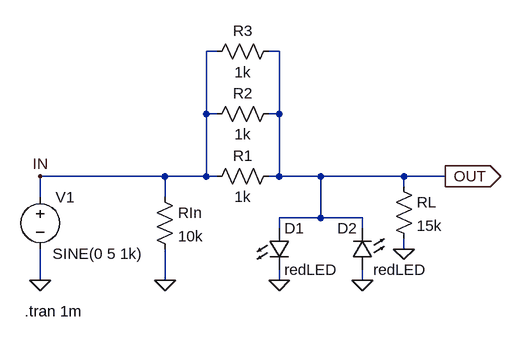
[diagram p0: schematic LED_Limiter_RL=15k_1kx3.asc]
LED_Limiter_RL=15k_1kx3.asc, the LTspice schematic file:
Version 4
SHEET 1 880 680
WIRE 128 -112 112 -112
WIRE 224 -112 208 -112
WIRE 112 -16 112 -112
WIRE 128 -16 112 -16
WIRE 224 -16 224 -112
WIRE 224 -16 208 -16
WIRE 48 80 -144 80
WIRE 112 80 112 -16
WIRE 112 80 48 80
WIRE 128 80 112 80
WIRE 224 80 224 -16
WIRE 224 80 208 80
WIRE 288 80 224 80
WIRE 416 80 288 80
WIRE 480 80 416 80
WIRE 416 96 416 80
WIRE -144 112 -144 80
WIRE 48 112 48 80
WIRE 288 144 288 80
WIRE 288 144 224 144
WIRE 352 144 288 144
WIRE 224 160 224 144
WIRE 352 160 352 144
WIRE 416 192 416 176
WIRE -144 240 -144 192
WIRE 48 240 48 192
WIRE 224 240 224 224
WIRE 352 240 352 224
FLAG 480 80 OUT
IOPIN 480 80 Out
FLAG -144 240 0
FLAG 224 240 0
FLAG 352 240 0
FLAG -144 80 IN
FLAG 416 192 0
FLAG 48 240 0
SYMBOL voltage -144 96 R0
WINDOW 3 19 103 Left 2
WINDOW 123 0 0 Left 2
WINDOW 39 0 0 Left 2
SYMATTR Value SINE(0 5 1k)
SYMATTR InstName V1
SYMBOL LED 208 160 R0
SYMATTR InstName D1
SYMATTR Value redLED
SYMBOL LED 368 224 R180
WINDOW 0 24 64 Left 2
WINDOW 3 -83 0 Left 2
SYMATTR InstName D2
SYMATTR Value redLED
SYMBOL res 224 64 R90
WINDOW 0 0 56 VBottom 2
WINDOW 3 32 56 VTop 2
SYMATTR InstName R1
SYMATTR Value 1k
SYMBOL res 400 80 R0
SYMATTR InstName RL
SYMATTR Value 15k
SYMBOL res 224 -32 R90
WINDOW 0 0 56 VBottom 2
WINDOW 3 32 56 VTop 2
SYMATTR InstName R2
SYMATTR Value 1k
SYMBOL res 32 96 R0
SYMATTR InstName RIn
SYMATTR Value 10k
SYMBOL res 224 -128 R90
WINDOW 0 0 56 VBottom 2
WINDOW 3 32 56 VTop 2
SYMATTR InstName R3
SYMATTR Value 1k
TEXT -168 288 Left 2 !.tran 1m

The netlist it stands for:
* LED_Limiter_RL=15k_1kx3.asc
V1 IN 0 SINE(0 5 1k)
D1 OUT 0 redLED
D2 0 OUT redLED
R1 OUT IN 1k
RL OUT 0 15k
R2 OUT IN 1k
RIn IN 0 10k
R3 OUT IN 1k
.model D D
.lib standard.dio
.tran 1m
.backanno
.end